# Altium schematic sheet ethernet.SchDoc
size A4
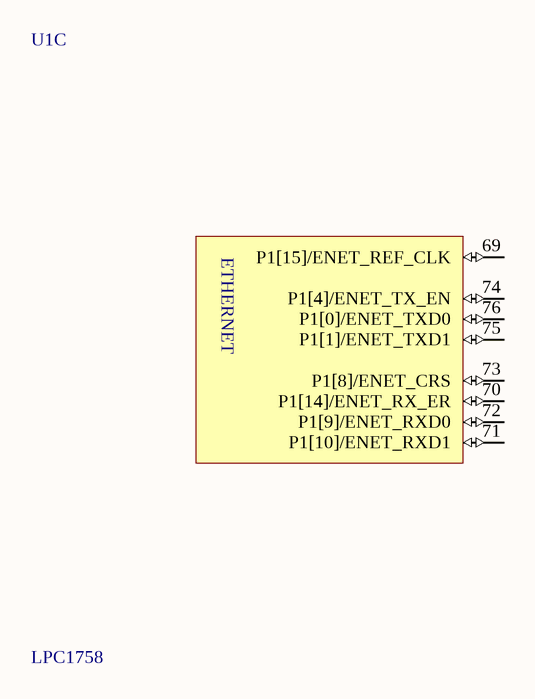
[diagram p0: ethernet.SchDoc]

## Parts
U1  LPC1758  [LPC1758FBD80]  (part C of 3)

## Nets

Not connected (* = marked no-connect by the designer): U1 69(P1[15]/ENET_REF_CLK) 70(P1[14]/ENET_RX_ER) 71(P1[10]/ENET_RXD1) 72(P1[9]/ENET_RXD0) 73(P1[8]/ENET_CRS) 74(P1[4]/ENET_TX_EN) 75(P1[1]/ENET_TXD1) 76(P1[0]/ENET_TXD0)

## Notes on the sheet
- (in symbol LPC1758, part C) ETHERNET

## Library data of the parts
U1 = LPC1758: NXP - LPC1758FBD80 - MCU, 32BIT, ARM CORTEX M3, 80LQFP; farnell: 1718545